# Altium schematic sheet ADC.SchDoc
size A4
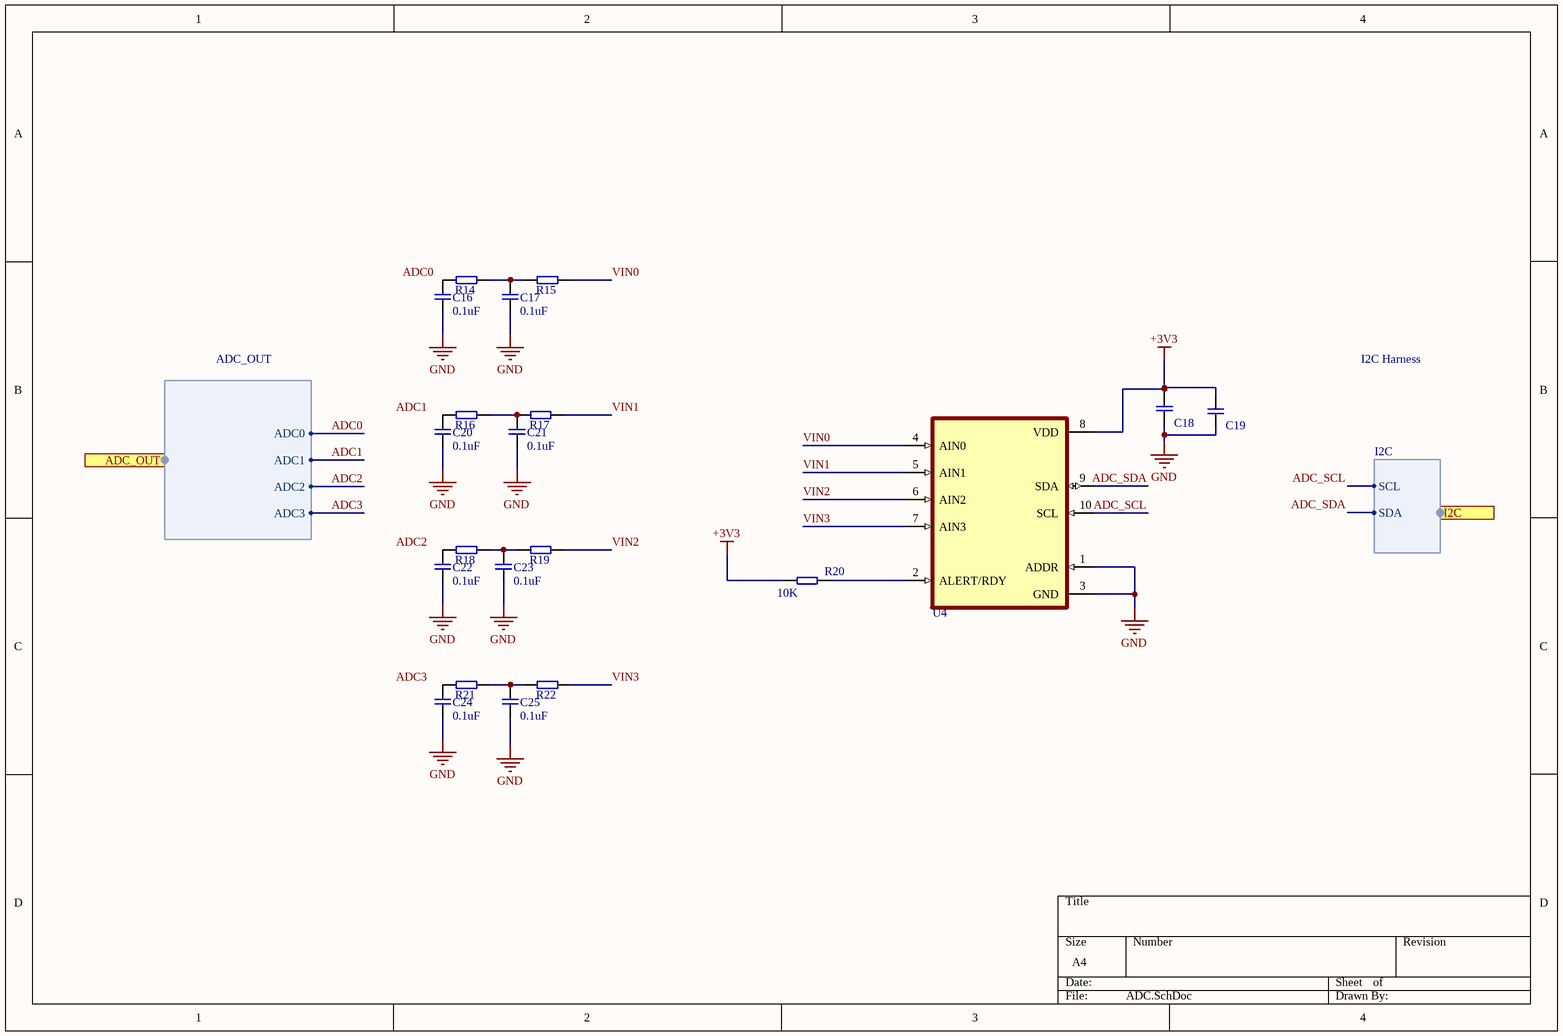
[diagram p0: ADC.SchDoc]

## Parts
C16  0.1uF  [C0402]
C17  0.1uF  [C0402]
C18  1uF  [C0603]  (value not drawn)
C19  10uF  [C0603]  (value not drawn)
C20  0.1uF  [C0402]
C21  0.1uF  [C0402]
C22  0.1uF  [C0402]
C23  0.1uF  [C0402]
C24  0.1uF  [C0402]
C25  0.1uF  [C0402]
R14  200R  [R0402]  (value not drawn)
R15  200R  [R0402]  (value not drawn)
R16  200R  [R0402]  (value not drawn)
R17  200R  [R0402]  (value not drawn)
R18  200R  [R0402]  (value not drawn)
R19  200R  [R0402]  (value not drawn)
R20  10K  [R0603]
R21  200R  [R0402]  (value not drawn)
R22  200R  [R0402]  (value not drawn)
U4  ADS1115IDGST  [ADS1115IDGST]  (value not drawn)

## Ports
ADC_OUT (harness ADC_OUT), I2C (harness I2C)

## Harnesses
I2C: SCL, SDA
ADC_OUT: ADC3, ADC2, ADC1, ADC0

## Nets
+3V3: C18.2 C19.2 R20.1 U4.8(VDD)
GND: C16.1 C17.1 C18.1 C19.1 C20.1 C21.1 C22.1 C23.1 C24.1 C25.1 U4.1(ADDR) U4.3(GND)
ADC0: port ADC_OUT.ADC0
ADC1: port ADC_OUT.ADC1
ADC2: port ADC_OUT.ADC2
ADC3: port ADC_OUT.ADC3
ADC_SCL: U4.10(SCL) ; port I2C.SCL
ADC_SDA: U4.9(SDA) ; port I2C.SDA
VIN0: R15.1 U4.4(AIN0)
VIN1: R17.1 U4.5(AIN1)
VIN2: R19.1 U4.6(AIN2)
VIN3: R22.1 U4.7(AIN3)
NetC16_2: C16.2 R14.2
NetC17_2: C17.2 R14.1 R15.2
NetC20_2: C20.2 R16.2
NetC21_2: C21.2 R16.1 R17.2
NetC22_2: C22.2 R18.2
NetC23_2: C23.2 R18.1 R19.2
NetC24_2: C24.2 R21.2
NetC25_2: C25.2 R21.1 R22.2
NetR20_2: R20.2 U4.2(ALERT/RDY)

## Notes on the sheet
- I2C Harness
- Labels drawn without touching a wire or pin: ADC0, ADC1, ADC2, ADC3

## Library data of the parts
C16 C17 C20-C25 = C1005X5R1A104K050BA: CAP CER 0.1UF 10V X5R 0402; Manufacturer: TDK Corporation; Que: 003; Tolerance: ±10%; Type: Ceramic; Name: Recep Aydin; Part Number: C1005X5R1A104K050BA; Voltage: 10V; Temperature Coefficient: X5R; Package: 0402(1005 Metric); Datasheet: https://product.tdk.com/en/system/files?file=dam/doc/product/capacitor/ceramic/mlcc/catalog/mlcc_commercial_general_en.pdf; Manufacturer Part Number: C1005X5R1A104K050BA
C18 = GMC10X5R105K16NT: CAP CER 1UF 16V X5R 0603; Manufacturer: CAL-CHIP ELECTRONICS, INC.; Que: 020; Tolerance: ±10%; Type: Ceramic; Name: Recep Aydin; Part Number: GMC10X5R105K16NT; Voltage: 16V; Temperature Coefficient: X5R; Package: 0603(1608 Metric); Datasheet: http://www.calchipelectronics.com/pdf/gmc_series.pdf; Manufacturer Part Number: GMC10X5R105K16NT
C19 = GRT188R61C106KE13D: CAP CER 10UF 16V X5R 0603; Manufacturer: Murata Electronics; Que: 073; Tolerance: ±10%; Type: Ceramic; Name: Recep Aydin; Part Number: GRT188R61C106KE13D; Voltage: 16V; Temperature Coefficient: X5R; Package: 0603(1608 Metric); Datasheet: https://search.murata.co.jp/Ceramy/image/img/A01X/G101/ENG/GRT188R61C106KE13-01.pdf; Manufacturer Part Number: GRT188R61C106KE13D
R14-R19 R21 R22 = 0402WGF2000TCE: RES.(1005) 0402 200 Ohms 1% 1/16W 100PPM; Que: 165; Part Number: 0402WGF2000TCE
R20 = RMCF0603FT10K0: RES 10K OHM 1% 1/10W 0603; Manufacturer: Stackpole Electronics Inc; Que: 051; Name: Recep Aydin; Part Number: RMCF0603FT10K0; Tolerance: 1%; Resistor Type: Thick Film; Package: 0603; Datasheet: https://www.seielect.com/catalog/sei-rmcf_rmcp.pdf; Manufacturer Part Number: RMCF0603FT10K0
U4 = ADS1115IDGST: IC ADC 16BIT SIGMA-DELTA 10VSSOP; Manufacturer: Texas Instruments; Que: 047; Name: İbrahim Akbulut; Package: 10VSSOP; Availability: Unavailable; Value: *; MP: ADS1115IDGST; Price: None; Part Number: ADS1115IDGST; Function: ADC; Datasheet: https://www.digikey.com/en/products/detail/texas-instruments/ADS1115IDGST/2123284; Manufacturer Part Number: ADS1115IDGST